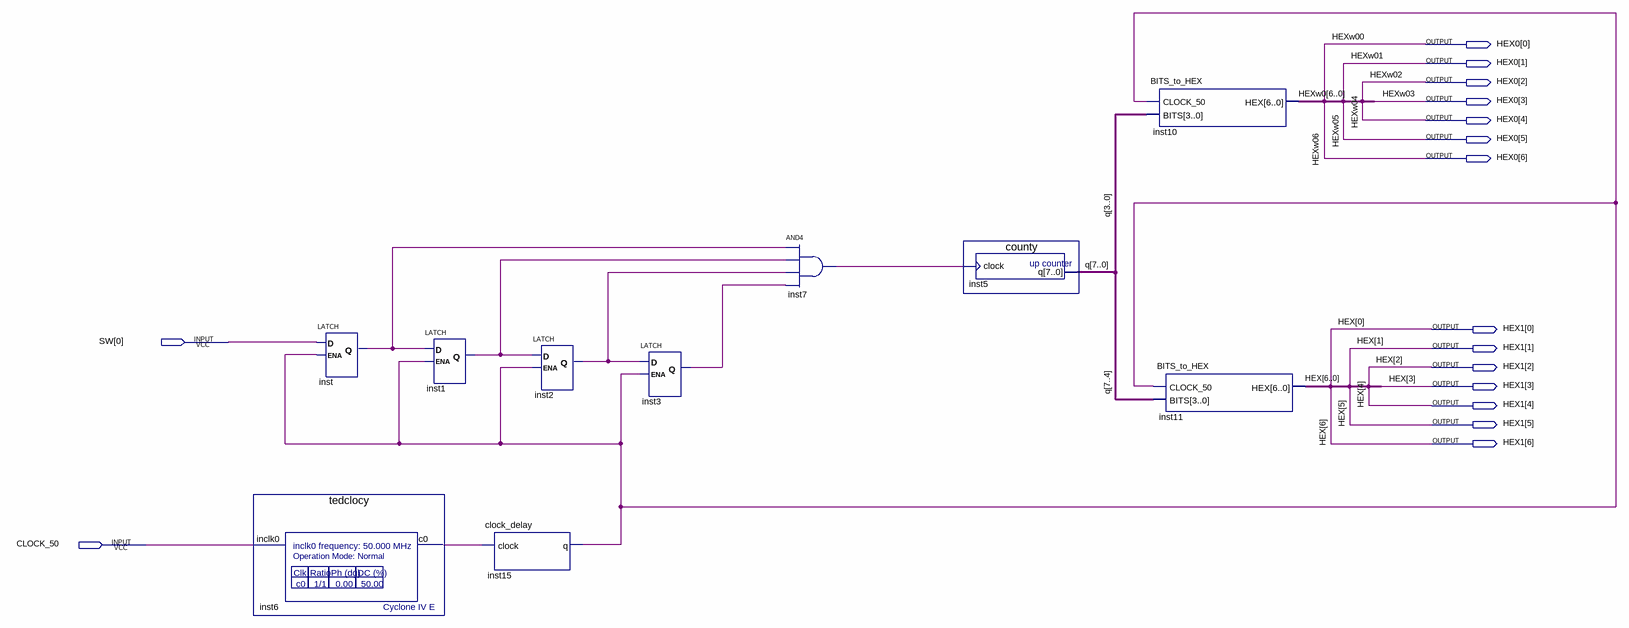
[diagram p0: schematic sheet]
// Quartus schematic debounce.bdf as structural Verilog: 10 symbols, 16 pins
module debounce (
  input  [0:0] SW,
  input  CLOCK_50,
  output [6:0] HEX0,
  output [6:0] HEX1
);

  wire inst1_q, inst2_q, inst3_q, inst6_c0, inst7_out, inst15_q, inst_q;
  wire [7:0] q;

  tedclocy inst6 (.inclk0(CLOCK_50), .c0(inst6_c0));
  LATCH inst (.D(SW[0]), .ENA(inst15_q), .Q(inst_q));
  LATCH inst1 (.D(inst_q), .ENA(inst15_q), .Q(inst1_q));
  clock_delay inst15 (.clock(inst6_c0), .q(inst15_q));
  LATCH inst2 (.D(inst1_q), .ENA(inst15_q), .Q(inst2_q));
  LATCH inst3 (.D(inst2_q), .ENA(inst15_q), .Q(inst3_q));
  and inst7 (inst7_out, inst_q, inst1_q, inst2_q, inst3_q);
  county inst5 (.clock(inst7_out), .q(q));
  BITS_to_HEX inst10 (.CLOCK_50(inst15_q), .BITS(q[3:0]), .HEX(HEX0));
  BITS_to_HEX inst11 (.CLOCK_50(inst15_q), .BITS(q[7:4]), .HEX(HEX1));

  // Other names for the same wires on the sheet: HEX[6:0] = HEX1; HEXw00 = HEX0[0]; HEXw0[6:0] = HEX0;
  //   HEXw01 = HEX0[1]; HEXw02 = HEX0[2]; HEXw03 = HEX0[3]; HEXw04 = HEX0[4]; HEXw05 = HEX0[5]; HEXw06 = HEX0[6]
endmodule
